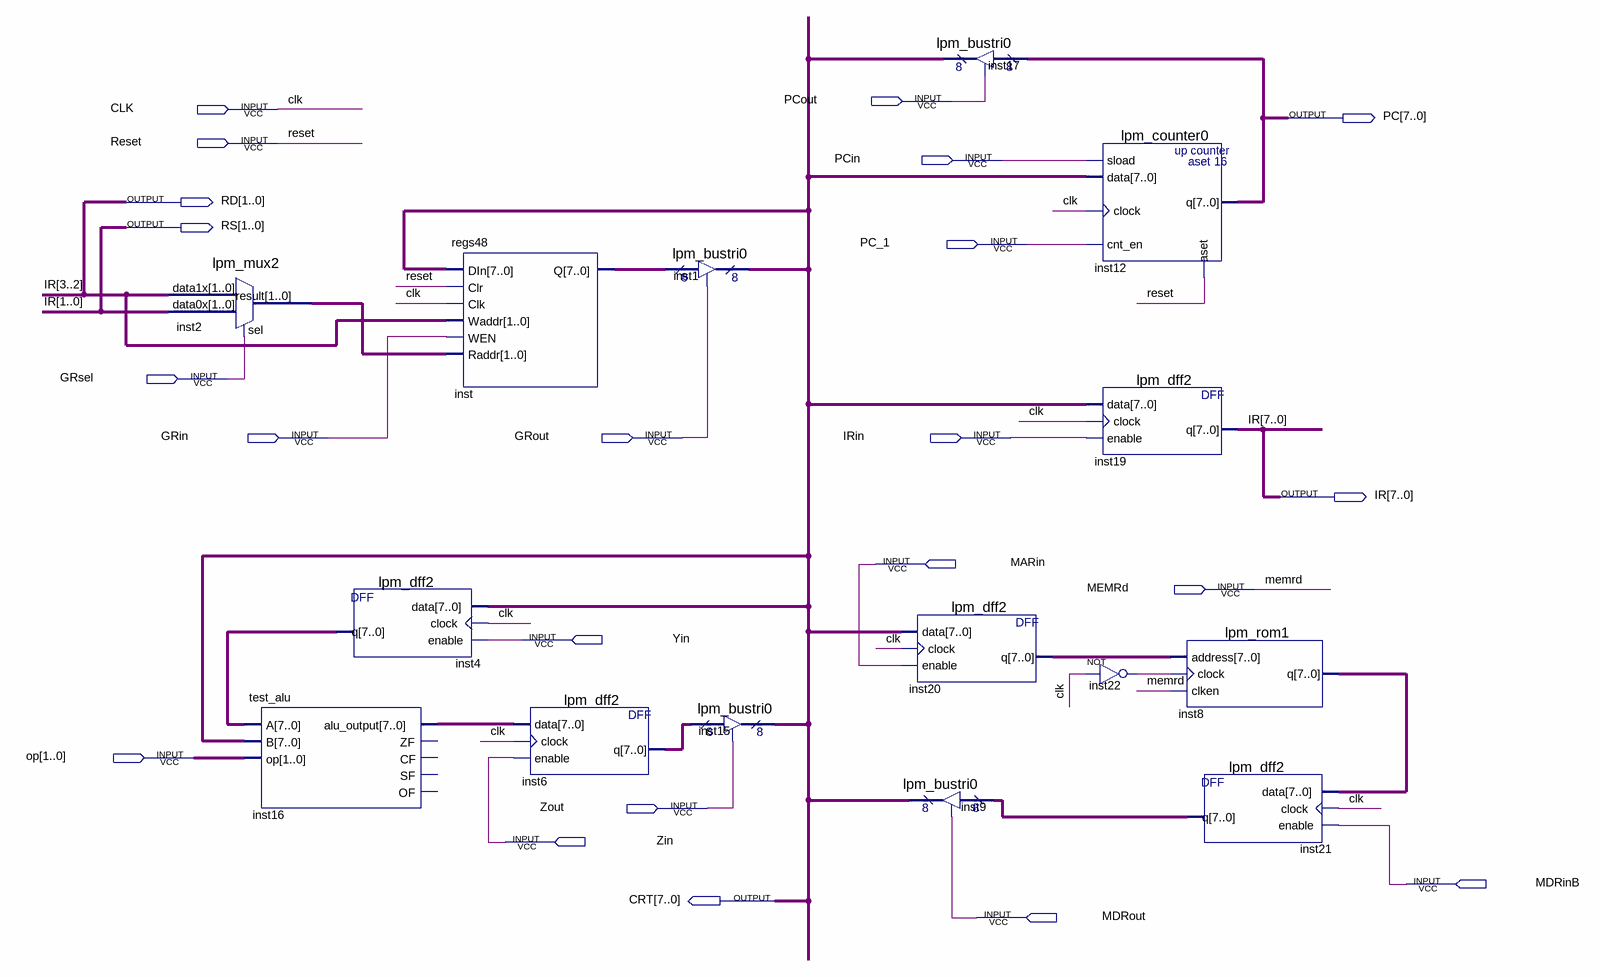
[diagram p0: schematic sheet]
// Quartus schematic datapath.bdf as structural Verilog: 15 symbols, 22 pins
module datapath (
  input  PCout,
  input  CLK,
  input  Reset,
  input  PCin,
  input  PC_1,
  input  GRsel,
  input  GRin,
  input  GRout,
  input  IRin,
  input  MARin,
  input  MEMRd,
  input  Yin,
  input  [1:0] op,
  input  Zout,
  input  Zin,
  input  MDRinB,
  input  MDRout,
  output [7:0] PC,
  output [1:0] RD,
  output [1:0] RS,
  output [7:0] IR,
  output [7:0] CRT
);

  wire inst22_out;
  wire [1:0] inst2_result;
  wire [7:0] inst4_q, inst6_q, inst8_q, inst16_alu_output, inst20_q, inst21_q, inst_q;

  lpm_mux2 inst2 (.data1x(IR[3:2]), .data0x(IR[1:0]), .sel(GRsel), .result(inst2_result));
  test_alu inst16 (.A(inst4_q), .B(CRT), .op(op), .alu_output(inst16_alu_output));  // open: ZF, CF, SF, OF
  lpm_dff2 inst4 (.data(CRT), .clock(CLK), .enable(Yin), .q(inst4_q));
  regs48 inst (.DIn(CRT), .Clr(Reset), .Clk(CLK), .Waddr(IR[3:2]), .WEN(GRin), .Raddr(inst2_result), .Q(inst_q));
  lpm_dff2 inst6 (.data(inst16_alu_output), .clock(CLK), .enable(Zin), .q(inst6_q));
  lpm_bustri0 inst1 (.enabledt(GRout), .data(inst_q), .tridata(CRT));
  lpm_bustri0 inst15 (.enabledt(Zout), .data(inst6_q), .tridata(CRT));
  lpm_dff2 inst20 (.data(CRT), .clock(CLK), .enable(MARin), .q(inst20_q));
  lpm_bustri0 inst9 (.enabledt(MDRout), .data(inst21_q), .tridata(CRT));
  lpm_bustri0 inst17 (.enabledt(PCout), .data(PC), .tridata(CRT));
  lpm_counter0 inst12 (.sload(PCin), .data(CRT), .clock(CLK), .cnt_en(PC_1), .aset(Reset), .q(PC));
  lpm_dff2 inst19 (.data(CRT), .clock(CLK), .enable(IRin), .q(IR));
  not inst22 (inst22_out, CLK);
  lpm_rom1 inst8 (.address(inst20_q), .clock(inst22_out), .clken(MEMRd), .q(inst8_q));
  lpm_dff2 inst21 (.data(inst8_q), .clock(CLK), .enable(MDRinB), .q(inst21_q));

  assign RD = IR[3:2];
  assign RS = IR[1:0];
endmodule
